# EAGLE schematic ElectroLab (EAGLE 9.5.1)

## Sheet 1 of 4
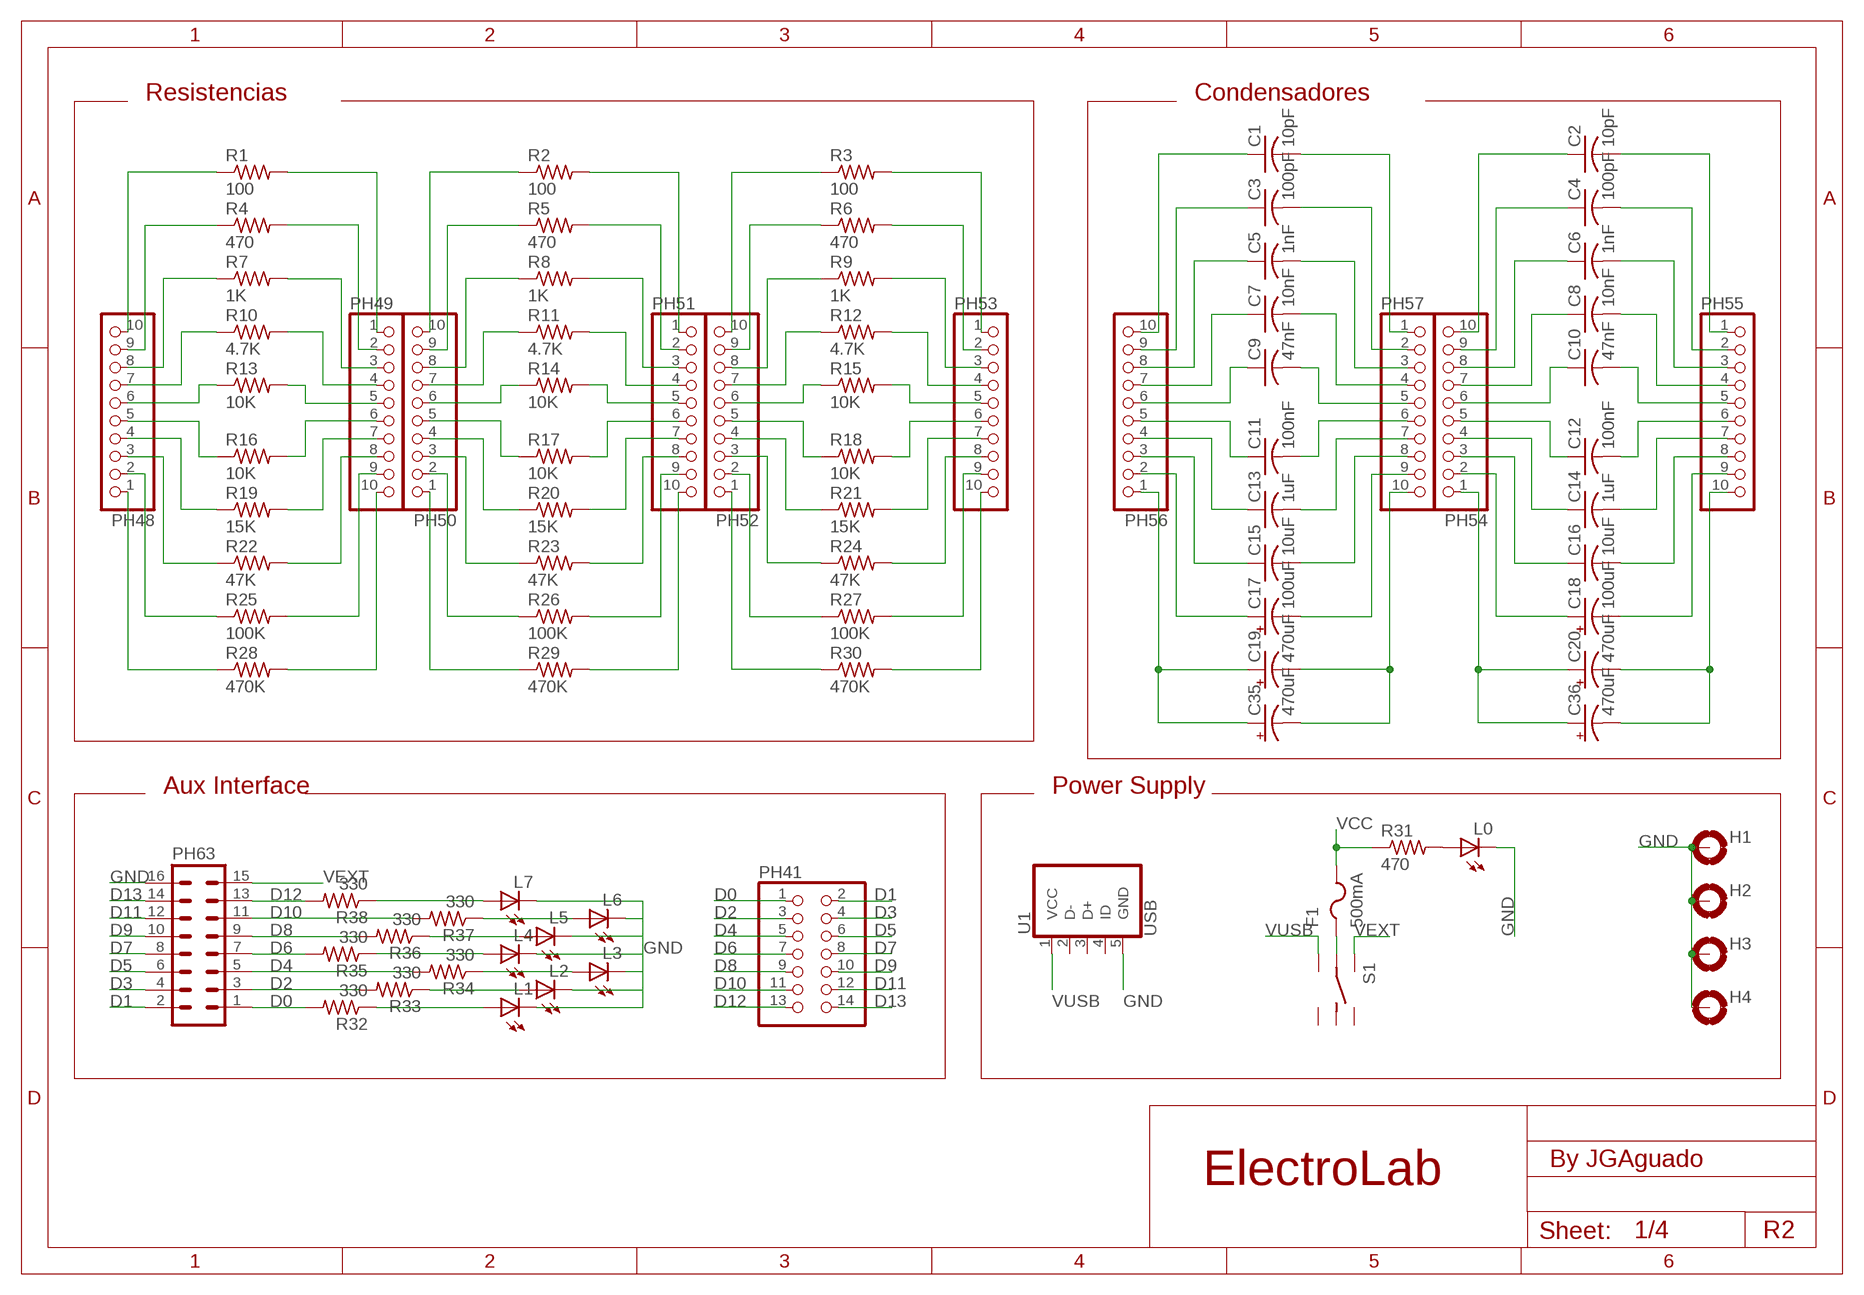
[diagram p0: schematic, sheet 1]

### Parts
C1  10pF  C-USC1206  [C1206]
C2  10pF  C-USC1206  [C1206]
C3  100pF  C-USC1206  [C1206]
C4  100pF  C-USC1206  [C1206]
C5  1nF  C-USC1206  [C1206]
C6  1nF  C-USC1206  [C1206]
C7  10nF  C-USC1206  [C1206]
C8  10nF  C-USC1206  [C1206]
C9  47nF  C-USC1206  [C1206]
C10  47nF  C-USC1206  [C1206]
C11  100nF  C-USC1206  [C1206]
C12  100nF  C-USC1206  [C1206]
C13  1uF  C-USC1206  [C1206]
C14  1uF  C-USC1206  [C1206]
C15  10uF  C-USC1206  [C1206]
C16  10uF  C-USC1206  [C1206]
C17  100uF  CPOL-USA/3216-18R  [A/3216-18R]
C18  100uF  CPOL-USA/3216-18R  [A/3216-18R]
C19  470uF  CPOL-USD/7343-31R  [D/7343-31R]
C20  470uF  CPOL-USD/7343-31R  [D/7343-31R]
C35  470uF  CPOL-USD/7343-31R  [D/7343-31R]
C36  470uF  CPOL-USD/7343-31R  [D/7343-31R]
F1  500mA  PTCFUSE-1206  [R1206]
H1  MOUNT-PAD-ROUND2.8  [2,8-PAD]
H2  MOUNT-PAD-ROUND2.8  [2,8-PAD]
H3  MOUNT-PAD-ROUND2.8  [2,8-PAD]
H4  MOUNT-PAD-ROUND2.8  [2,8-PAD]
L0  LEDSMT1206  [1206]
L1  LEDSMT1206  [1206]
L2  LEDSMT1206  [1206]
L3  LEDSMT1206  [1206]
L4  LEDSMT1206  [1206]
L5  LEDSMT1206  [1206]
L6  LEDSMT1206  [1206]
L7  LEDSMT1206  [1206]
PH41  PINHD-2X7  [2X07]
PH48  PINHD-1X10  [1X10-BIG]
PH49  PINHD-1X10  [1X10-BIG]
PH50  PINHD-1X10  [1X10-BIG]
PH51  PINHD-1X10  [1X10-BIG]
PH52  PINHD-1X10  [1X10-BIG]
PH53  PINHD-1X10  [1X10-BIG]
PH54  PINHD-1X10  [1X10-BIG]
PH55  PINHD-1X10  [1X10-BIG]
PH56  PINHD-1X10  [1X10-BIG]
PH57  PINHD-1X10  [1X10-BIG]
PH63  MA08-2  [MA08-2]
R1  100  R-US_R1206  [R1206]
R2  100  R-US_R1206  [R1206]
R3  100  R-US_R1206  [R1206]
R4  470  R-US_R1206  [R1206]
R5  470  R-US_R1206  [R1206]
R6  470  R-US_R1206  [R1206]
R7  1K  R-US_R1206  [R1206]
R8  1K  R-US_R1206  [R1206]
R9  1K  R-US_R1206  [R1206]
R10  4.7K  R-US_R1206  [R1206]
R11  4.7K  R-US_R1206  [R1206]
R12  4.7K  R-US_R1206  [R1206]
R13  10K  R-US_R1206  [R1206]
R14  10K  R-US_R1206  [R1206]
R15  10K  R-US_R1206  [R1206]
R16  10K  R-US_R1206  [R1206]
R17  10K  R-US_R1206  [R1206]
R18  10K  R-US_R1206  [R1206]
R19  15K  R-US_R1206  [R1206]
R20  15K  R-US_R1206  [R1206]
R21  15K  R-US_R1206  [R1206]
R22  47K  R-US_R1206  [R1206]
R23  47K  R-US_R1206  [R1206]
R24  47K  R-US_R1206  [R1206]
R25  100K  R-US_R1206  [R1206]
R26  100K  R-US_R1206  [R1206]
R27  100K  R-US_R1206  [R1206]
R28  470K  R-US_R1206  [R1206]
R29  470K  R-US_R1206  [R1206]
R30  470K  R-US_R1206  [R1206]
R31  470  R-US_R1206  [R1206]
R32  330  R-US_R1206  [R1206]
R33  330  R-US_R1206  [R1206]
R34  330  R-US_R1206  [R1206]
R35  330  R-US_R1206  [R1206]
R36  330  R-US_R1206  [R1206]
R37  330  R-US_R1206  [R1206]
R38  330  R-US_R1206  [R1206]
S1  DPDT_JS202011CQN  [DPDT_JS202011CQN]
U1  USB  USB-RECEPTABLE  [FCI-10103594-0001LF]

### Nets
D0: PH41.1 PH63.1 R32.2
D1: PH41.2 PH63.2
D2: PH41.3 PH63.3 R33.2
D3: PH41.4 PH63.4
D4: PH41.5 PH63.5 R34.2
D5: PH41.6 PH63.6
D6: PH41.7 PH63.7 R35.2
D7: PH41.8 PH63.8
D8: PH41.9 PH63.9 R36.2
D9: PH41.10 PH63.10
D10: PH41.11 PH63.11 R37.2
D11: PH41.12 PH63.12
D12: PH41.13 PH63.13 R38.2
D13: PH41.14 PH63.14
GND: H1.B2,8(MOUNT) H2.B2,8(MOUNT) H3.B2,8(MOUNT) H4.B2,8(MOUNT) L0.C L1.C L2.C L3.C L4.C L5.C L6.C L7.C PH63.16 U1.5(GND) ; also sheet 2,3,4
N$1: PH48.10 R1.1
N$2: PH48.9 R4.1
N$3: PH48.8 R7.1
N$4: PH48.7 R10.1
N$5: PH48.6 R13.1
N$6: PH48.5 R16.1
N$7: PH48.4 R19.1
N$8: PH48.3 R22.1
N$9: PH48.2 R25.1
N$10: PH48.1 R28.1
N$11: PH49.10 R28.2
N$12: PH49.9 R25.2
N$13: PH49.8 R22.2
N$14: PH49.7 R19.2
N$15: PH49.5 R13.2
N$16: PH49.6 R16.2
N$17: PH49.4 R10.2
N$18: PH49.3 R7.2
N$19: PH49.2 R4.2
N$20: PH49.1 R1.2
N$21: PH50.10 R2.1
N$22: PH50.9 R5.1
N$23: PH50.8 R8.1
N$24: PH50.7 R11.1
N$25: PH50.6 R14.1
N$26: PH50.5 R17.1
N$27: PH50.4 R20.1
N$28: PH50.3 R23.1
N$29: PH50.2 R26.1
N$30: PH50.1 R29.1
N$31: PH51.10 R29.2
N$32: PH51.9 R26.2
N$33: PH51.8 R23.2
N$34: PH51.7 R20.2
N$35: PH51.6 R17.2
N$36: PH51.5 R14.2
N$37: PH51.4 R11.2
N$38: PH51.3 R8.2
N$39: PH51.2 R5.2
N$40: PH51.1 R2.2
N$41: PH52.10 R3.1
N$42: PH52.9 R6.1
N$43: PH52.8 R9.1
N$44: PH52.7 R12.1
N$45: PH52.6 R15.1
N$46: PH52.5 R18.1
N$47: PH52.4 R21.1
N$48: PH52.3 R24.1
N$49: PH52.2 R27.1
N$50: PH52.1 R30.1
N$51: PH53.10 R30.2
N$52: PH53.9 R27.2
N$53: PH53.8 R24.2
N$54: PH53.7 R21.2
N$55: PH53.6 R18.2
N$56: PH53.5 R15.2
N$57: PH53.4 R12.2
N$58: PH53.3 R9.2
N$59: PH53.2 R6.2
N$60: PH53.1 R3.2
N$61: C1.1 PH56.10
N$62: C3.1 PH56.9
N$63: C5.1 PH56.8
N$64: C7.1 PH56.7
N$65: C9.1 PH56.6
N$66: C11.1 PH56.5
N$67: C13.1 PH56.4
N$68: C15.1 PH56.3
N$69: C17.+ PH56.2
N$70: C19.+ C35.+ PH56.1
N$71: C1.2 PH57.1
N$72: C3.2 PH57.2
N$73: C5.2 PH57.3
N$74: C7.2 PH57.4
N$75: C9.2 PH57.5
N$76: C11.2 PH57.6
N$77: C13.2 PH57.7
N$78: C15.2 PH57.8
N$79: C17.- PH57.9
N$80: C19.- C35.- PH57.10
N$81: C2.1 PH54.10
N$82: C4.1 PH54.9
N$83: C6.1 PH54.8
N$84: C8.1 PH54.7
N$85: C10.1 PH54.6
N$86: C12.1 PH54.5
N$87: C14.1 PH54.4
N$88: C16.1 PH54.3
N$89: C18.+ PH54.2
N$90: C20.+ C36.+ PH54.1
N$91: C20.- C36.- PH55.10
N$92: C18.- PH55.9
N$93: C16.2 PH55.8
N$94: C14.2 PH55.7
N$95: C12.2 PH55.6
N$96: C10.2 PH55.5
N$97: C8.2 PH55.4
N$98: C6.2 PH55.3
N$99: C4.2 PH55.2
N$100: C2.2 PH55.1
N$102: L1.A R32.1
N$103: L0.A R31.2
N$104: L2.A R33.1
N$105: L3.A R34.1
N$106: L4.A R35.1
N$107: L5.A R36.1
N$108: L6.A R37.1
N$109: L7.A R38.1
N$118: F1.1 S1.2(LC)
VCC: F1.2 R31.1 ; also sheet 2,3,4
VEXT: PH63.15 S1.1(L1)
VUSB: S1.3(L2) U1.1(VCC)
Unconnected: S1.4(R1) S1.5(RC) S1.6(R2) U1.2(D-) U1.3(D+) U1.4(ID)

### Notes on the sheet
- Resistencias | Condensadores
- Aux Interface | Power Supply
- By JGAguado
- R2

## Sheet 2 of 4
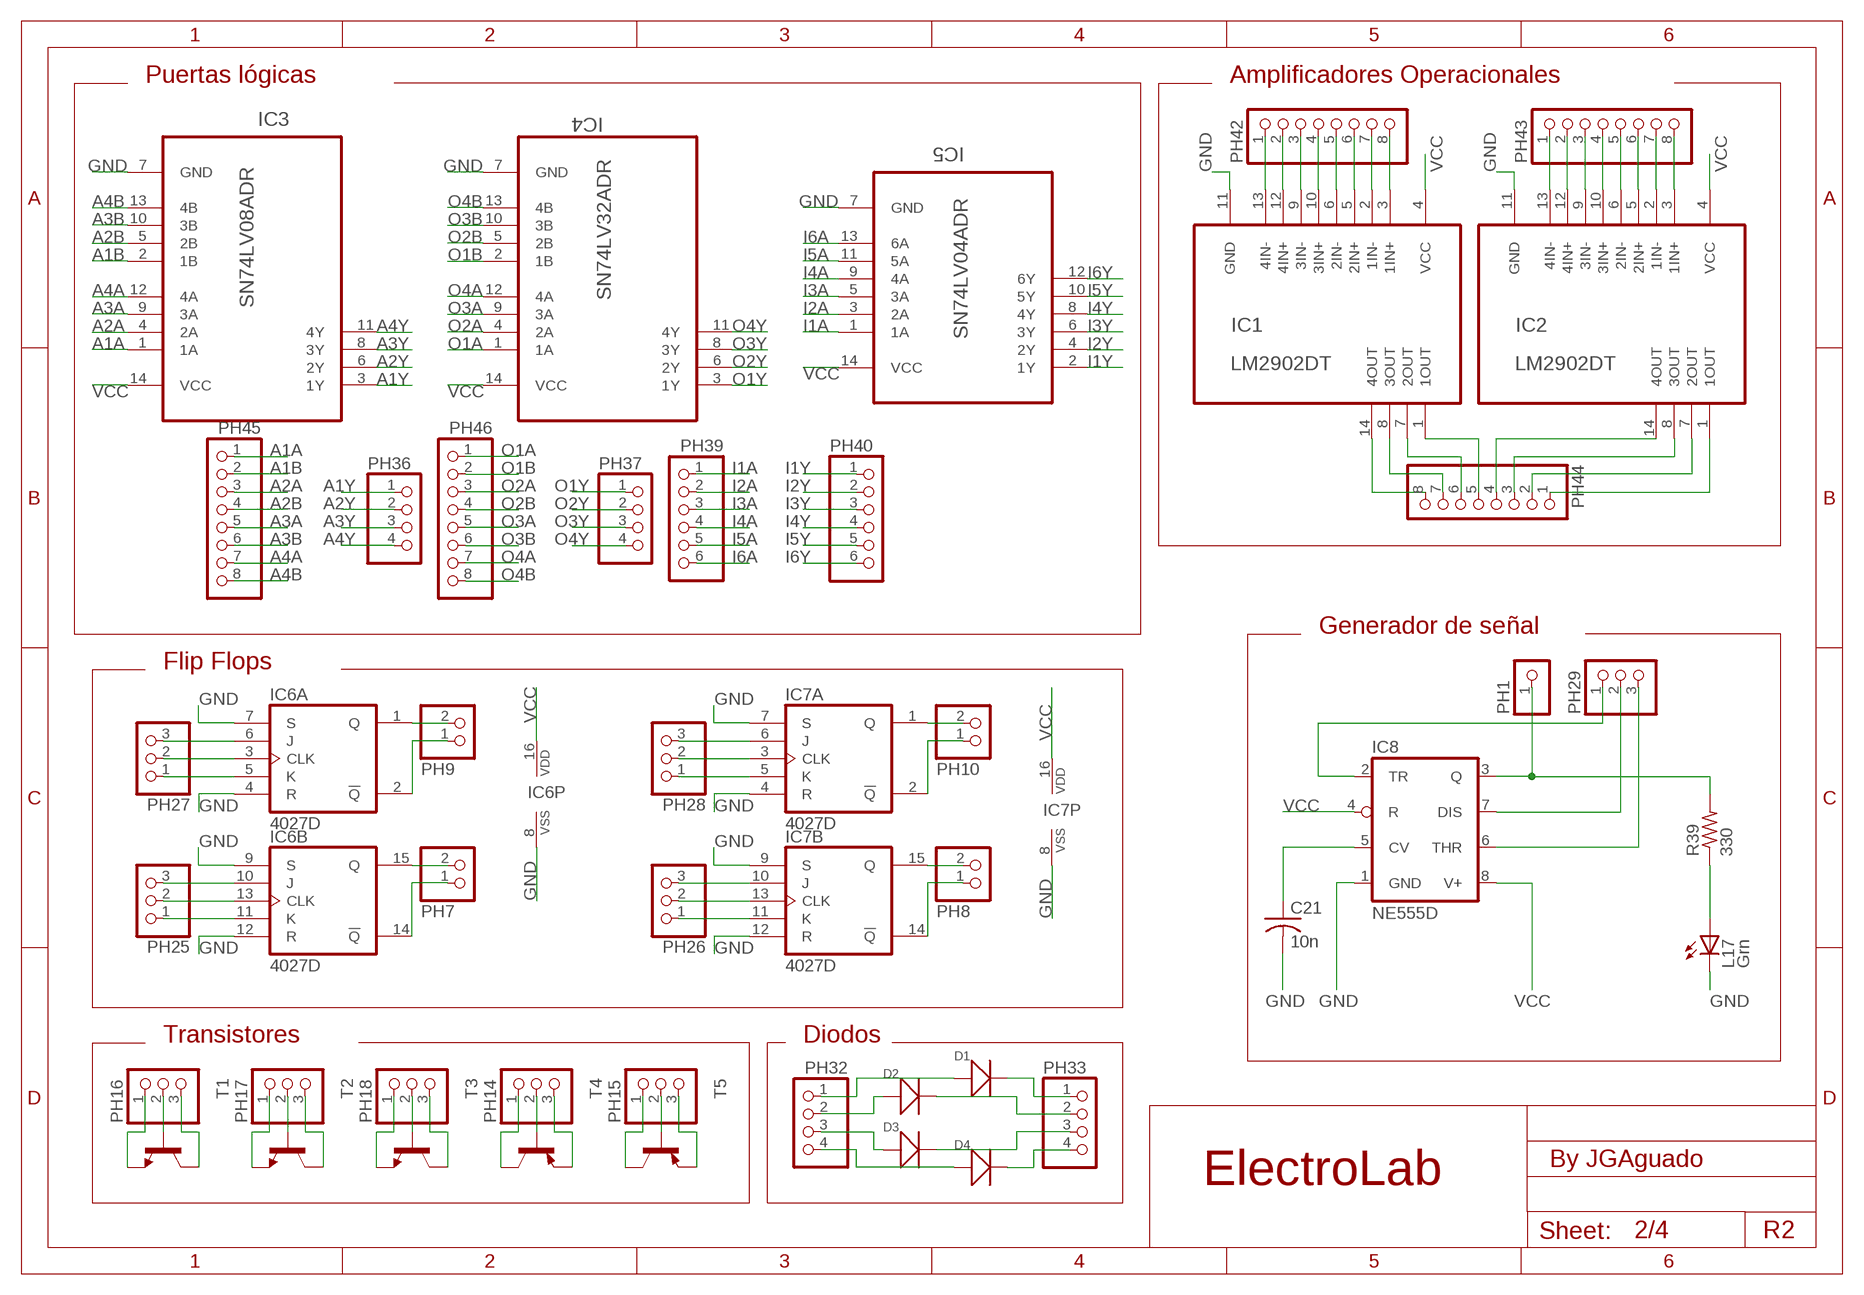
[diagram p1: schematic, sheet 2]

### Parts
C21  10n  C0603  [0603]
D1  SMD-DIODE-SWITCHING-75V-150MA(D1206)  [LED-1206]
D2  SMD-DIODE-SWITCHING-75V-150MA(D1206)  [LED-1206]
D3  SMD-DIODE-SWITCHING-75V-150MA(D1206)  [LED-1206]
D4  SMD-DIODE-SWITCHING-75V-150MA(D1206)  [LED-1206]
IC1  LM2902DT  [SOIC127P600X175-14N]
IC2  LM2902DT  [SOIC127P600X175-14N]
IC3  SN74LV08ADR  SN74LVC08AD  [SOIC127P600X175-14N]
IC4  SN74LV32ADR  SN74S32D  [SOIC127P600X175-14N]
IC5  SN74LV04ADR  [SOIC127P600X175-14N]
IC6  4027D  [SO16]
IC7  4027D  [SO16]
IC8  NE555D  [SO08]
L17  Grn  LEDSMT1206  [1206]
PH1  PINHD-1X1  [1X01]
PH7  PINHD-1X2  [1X02]
PH8  PINHD-1X2  [1X02]
PH9  PINHD-1X2  [1X02]
PH10  PINHD-1X2  [1X02]
PH14  PINHD-1X3  [1X03]
PH15  PINHD-1X3  [1X03]
PH16  PINHD-1X3  [1X03]
PH17  PINHD-1X3  [1X03]
PH18  PINHD-1X3  [1X03]
PH25  PINHD-1X3  [1X03]
PH26  PINHD-1X3  [1X03]
PH27  PINHD-1X3  [1X03]
PH28  PINHD-1X3  [1X03]
PH29  PINHD-1X3  [1X03]
PH32  PINHD-1X4  [1X04]
PH33  PINHD-1X4  [1X04]
PH36  PINHD-1X4  [1X04]
PH37  PINHD-1X4  [1X04]
PH39  PINHD-1X6  [1X06]
PH40  PINHD-1X6  [1X06]
PH42  PINHD-1X8  [1X08]
PH43  PINHD-1X8  [1X08]
PH44  PINHD-1X8  [1X08]
PH45  PINHD-1X8  [1X08]
PH46  PINHD-1X8  [1X08]
R39  330  R-US_R1206  [R1206]
T1  BC817-16-NPN-SOT23-BEC  [SOT23-BEC]
T2  BC817-16-NPN-SOT23-BEC  [SOT23-BEC]
T3  BC817-16-NPN-SOT23-BEC  [SOT23-BEC]
T4  -PNP-SOT23-BCE  [SOT23-BCE]
T5  -PNP-SOT23-BCE  [SOT23-BCE]

### Nets
A1A: IC3.1(1A) PH45.1 ; also sheet 4
A1B: IC3.2(1B) PH45.2 ; also sheet 4
A1Y: IC3.3(1Y) PH36.1
A2A: IC3.4(2A) PH45.3 ; also sheet 4
A2B: IC3.5(2B) PH45.4 ; also sheet 4
A2Y: IC3.6(2Y) PH36.2
A3A: IC3.9(3A) PH45.5 ; also sheet 4
A3B: IC3.10(3B) PH45.6 ; also sheet 4
A3Y: IC3.8(3Y) PH36.3
A4A: IC3.12(4A) PH45.7 ; also sheet 4
A4B: IC3.13(4B) PH45.8 ; also sheet 4
A4Y: IC3.11(4Y) PH36.4
GND: C21.2 IC1.11(GND) IC2.11(GND) IC3.7(GND) IC4.7(GND) IC5.7(GND) IC6.4(A:R) IC6.7(A:S) IC6.8(P:VSS) IC6.9(B:S) IC6.12(B:R) IC7.4(A:R) IC7.7(A:S) IC7.8(P:VSS) IC7.9(B:S) IC7.12(B:R) IC8.1(GND) L17.C ; also sheet 1,3,4
I1A: IC5.1(1A) PH39.1 ; also sheet 4
I1Y: IC5.2(1Y) PH40.1
I2A: IC5.3(2A) PH39.2 ; also sheet 4
I2Y: IC5.4(2Y) PH40.2
I3A: IC5.5(3A) PH39.3 ; also sheet 4
I3Y: IC5.6(3Y) PH40.3
I4A: IC5.9(4A) PH39.4 ; also sheet 4
I4Y: IC5.8(4Y) PH40.4
I5A: IC5.11(5A) PH39.5 ; also sheet 4
I5Y: IC5.10(5Y) PH40.5
I6A: IC5.13(6A) PH39.6 ; also sheet 4
I6Y: IC5.12(6Y) PH40.6
N$101: D4.+ PH32.4
N$110: D4.- PH33.4
N$111: D1.+ PH32.1
N$112: IC6.1(A:Q) PH9.2
N$113: IC6.15(B:Q) PH7.2
N$114: IC7.1(A:Q) PH10.2
N$115: IC7.15(B:Q) PH8.2
N$122: L17.A R39.1
N$130: IC1.13(4IN-) PH42.1
N$131: IC1.12(4IN+) PH42.2
N$132: IC1.9(3IN-) PH42.3
N$133: IC1.10(3IN+) PH42.4
N$134: IC1.6(2IN-) PH42.5
N$135: IC1.5(2IN+) PH42.6
N$136: IC1.2(1IN-) PH42.7
N$137: IC1.3(1IN+) PH42.8
N$138: IC2.13(4IN-) PH43.1
N$146: IC6.5(A:K) PH27.1
N$155: IC6.3(A:CLK) PH27.2
N$156: IC6.6(A:J) PH27.3
N$157: IC6.11(B:K) PH25.1
N$158: IC6.13(B:CLK) PH25.2
N$159: IC6.10(B:J) PH25.3
N$160: IC7.5(A:K) PH28.1
N$161: IC7.3(A:CLK) PH28.2
N$162: IC7.6(A:J) PH28.3
N$171: IC7.11(B:K) PH26.1
N$172: IC7.13(B:CLK) PH26.2
N$173: IC7.10(B:J) PH26.3
N$178: IC6.2(A:!Q) PH9.1
N$179: IC6.14(B:!Q) PH7.1
N$180: IC7.2(A:!Q) PH10.1
N$181: IC7.14(B:!Q) PH8.1
N$183: D3.+ PH32.3
N$184: D2.+ PH32.2
N$186: IC2.12(4IN+) PH43.2
N$187: IC2.9(3IN-) PH43.3
N$188: IC2.10(3IN+) PH43.4
N$189: IC2.6(2IN-) PH43.5
N$190: IC2.5(2IN+) PH43.6
N$191: IC2.2(1IN-) PH43.7
N$192: IC2.3(1IN+) PH43.8
N$193: IC1.14(4OUT) PH44.8
N$194: IC1.8(3OUT) PH44.7
N$195: IC1.7(2OUT) PH44.6
N$196: IC1.1(1OUT) PH44.5
N$197: IC2.14(4OUT) PH44.4
N$198: IC2.8(3OUT) PH44.3
N$199: D1.- PH33.1
N$200: IC2.7(2OUT) PH44.2
N$201: IC2.1(1OUT) PH44.1
N$202: D2.- PH33.2
N$203: D3.- PH33.3
N$205: PH16.1 T1.E
N$206: PH16.2 T1.B
N$207: PH16.3 T1.C
N$208: PH17.1 T2.E
N$209: PH17.2 T2.B
N$210: PH17.3 T2.C
N$211: PH18.1 T3.E
N$212: PH18.2 T3.B
N$213: PH18.3 T3.C
N$217: PH14.1 T4.C
N$218: PH14.2 T4.B
N$219: PH14.3 T4.E
N$220: PH15.1 T5.C
N$221: PH15.2 T5.B
N$222: PH15.3 T5.E
N$223: IC8.2(TR) PH29.1
N$224: IC8.3(Q) PH1.1 R39.2
N$225: C21.1 IC8.5(CV)
N$226: IC8.7(DIS) PH29.2
N$227: IC8.6(THR) PH29.3
O1A: IC4.1(1A) PH46.1 ; also sheet 4
O1B: IC4.2(1B) PH46.2 ; also sheet 4
O1Y: IC4.3(1Y) PH37.1
O2A: IC4.4(2A) PH46.3 ; also sheet 4
O2B: IC4.5(2B) PH46.4 ; also sheet 4
O2Y: IC4.6(2Y) PH37.2
O3A: IC4.9(3A) PH46.5 ; also sheet 4
O3B: IC4.10(3B) PH46.6 ; also sheet 4
O3Y: IC4.8(3Y) PH37.3
O4A: IC4.12(4A) PH46.7 ; also sheet 4
O4B: IC4.13(4B) PH46.8 ; also sheet 4
O4Y: IC4.11(4Y) PH37.4
VCC: IC1.4(VCC) IC2.4(VCC) IC3.14(VCC) IC4.14(VCC) IC5.14(VCC) IC6.16(P:VDD) IC7.16(P:VDD) IC8.4(R) IC8.8(V+) ; also sheet 1,3,4

### Notes on the sheet
- Puertas lógicas | Amplificadores Operacionales
- Generador de señal
- Flip Flops
- Transistores | Diodos
- By JGAguado
- R2

## Sheet 3 of 4
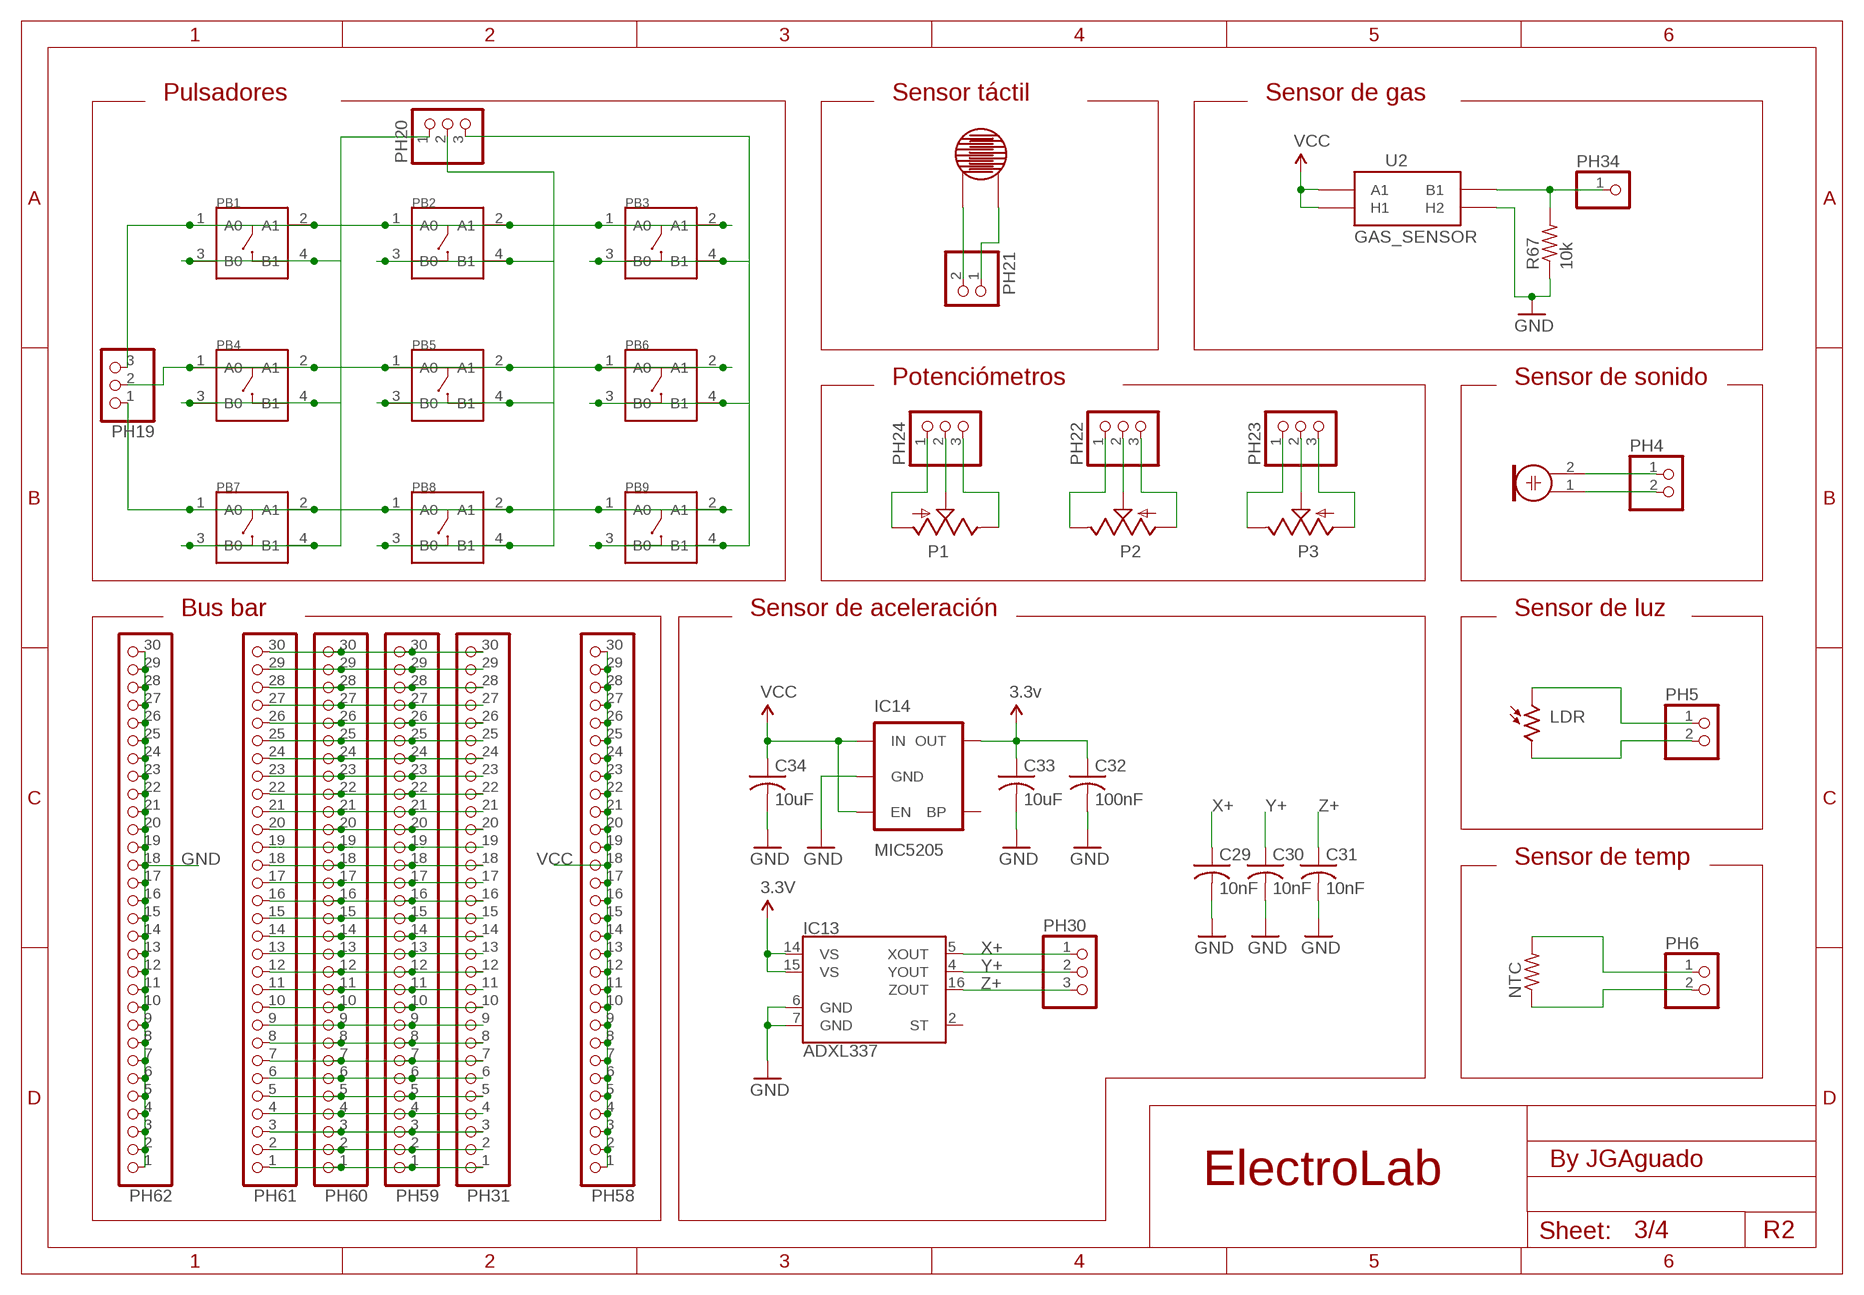
[diagram p2: schematic, sheet 3]

### Parts
C29  10nF  C0603  [0603]
C30  10nF  C0603  [0603]
C31  10nF  C0603  [0603]
C32  100nF  C0603  [0603]
C33  10uF  C0603  [0603]
C34  10uF  C0603  [0603]
IC13  ADXL337  [LFCSP-3X3]
IC14  MIC5205  V_REG_LDOSMD  [SOT23-5]
LDR  V1060_21  [TO-5_V10]
MIC  ELECTRET_MICROPHON-WM-64PC/64PK  [WM-64PC/64PK]
NTC  R-US_R1206  [R1206@1]
P1  SLIDE_POT_20MM  [SLIDE_POT_20MM]
P2  ALPS_RK09K_VERTICAL  [ALPS_RK09K_VERTICAL]
P3  ALPS_RK09K_VERTICAL  [ALPS_RK09K_VERTICAL]
PB1  SMD-SWITCH-TACTILE-SPST-NO/TS-1109(4P-D6.0MM)  [SW4-SMD-6.0X6.0X5.0MM]
PB2  SMD-SWITCH-TACTILE-SPST-NO/TS-1109(4P-D6.0MM)  [SW4-SMD-6.0X6.0X5.0MM]
PB3  SMD-SWITCH-TACTILE-SPST-NO/TS-1109(4P-D6.0MM)  [SW4-SMD-6.0X6.0X5.0MM]
PB4  SMD-SWITCH-TACTILE-SPST-NO/TS-1109(4P-D6.0MM)  [SW4-SMD-6.0X6.0X5.0MM]
PB5  SMD-SWITCH-TACTILE-SPST-NO/TS-1109(4P-D6.0MM)  [SW4-SMD-6.0X6.0X5.0MM]
PB6  SMD-SWITCH-TACTILE-SPST-NO/TS-1109(4P-D6.0MM)  [SW4-SMD-6.0X6.0X5.0MM]
PB7  SMD-SWITCH-TACTILE-SPST-NO/TS-1109(4P-D6.0MM)  [SW4-SMD-6.0X6.0X5.0MM]
PB8  SMD-SWITCH-TACTILE-SPST-NO/TS-1109(4P-D6.0MM)  [SW4-SMD-6.0X6.0X5.0MM]
PB9  SMD-SWITCH-TACTILE-SPST-NO/TS-1109(4P-D6.0MM)  [SW4-SMD-6.0X6.0X5.0MM]
PH4  PINHD-1X2  [1X02]
PH5  PINHD-1X2  [1X02]
PH6  PINHD-1X2  [1X02]
PH19  PINHD-1X3  [1X03]
PH20  PINHD-1X3  [1X03]
PH21  PINHD-1X2  [1X02]
PH22  PINHD-1X3  [1X03]
PH23  PINHD-1X3  [1X03]
PH24  PINHD-1X3  [1X03]
PH30  PINHD-1X3  [1X03]
PH31  PINHD-1X30  [1X30]
PH34  PINHD-1X1  [1X01]
PH58  PINHD-1X30  [1X30]
PH59  PINHD-1X30  [1X30]
PH60  PINHD-1X30  [1X30]
PH61  PINHD-1X30  [1X30]
PH62  PINHD-1X30  [1X30]
R67  10k  R0603  [0603]
U2  GAS_SENSOR  [MQ-3]
U$16  RESISTIVE_SENSOR_PAD  [RESISTIVE_SENSOR_PAD]

### Nets
3.3V: C32.1 C33.1 IC13.14(VS) IC13.15(VS) IC14.5(OUT) ; supply symbol labelled 3.3v
GND: C29.2 C30.2 C31.2 C32.2 C33.2 C34.2 IC13.6(GND) IC13.7(GND) IC14.2(GND) PH62.1 PH62.2 PH62.3 PH62.4 PH62.5 PH62.6 PH62.7 PH62.8 PH62.9 PH62.10 PH62.11 PH62.12 PH62.13 PH62.14 PH62.15 PH62.16 PH62.17 PH62.18 PH62.19 PH62.20 PH62.21 PH62.22 PH62.23 PH62.24 PH62.25 PH62.26 PH62.27 PH62.28 PH62.29 PH62.30 R67.1 U2.HB(H2) ; also sheet 1,2,4
N$119: PH34.1 R67.2 U2.B1
N$125: PH21.1 U$16.0
N$126: PH21.2 U$16.1
N$127: PH31.7 PH59.7 PH60.7 PH61.7
N$128: PH31.1 PH59.1 PH60.1 PH61.1
N$129: PH31.2 PH59.2 PH60.2 PH61.2
N$139: PH31.3 PH59.3 PH60.3 PH61.3
N$140: PH31.4 PH59.4 PH60.4 PH61.4
N$141: PH31.5 PH59.5 PH60.5 PH61.5
N$142: PH31.6 PH59.6 PH60.6 PH61.6
N$143: PH31.8 PH59.8 PH60.8 PH61.8
N$144: PH31.9 PH59.9 PH60.9 PH61.9
N$145: PH31.10 PH59.10 PH60.10 PH61.10
N$147: PH31.11 PH59.11 PH60.11 PH61.11
N$148: PH31.12 PH59.12 PH60.12 PH61.12
N$149: PH31.13 PH59.13 PH60.13 PH61.13
N$150: PH31.14 PH59.14 PH60.14 PH61.14
N$151: PH31.15 PH59.15 PH60.15 PH61.15
N$152: PH31.16 PH59.16 PH60.16 PH61.16
N$153: PH31.17 PH59.17 PH60.17 PH61.17
N$154: PH31.18 PH59.18 PH60.18 PH61.18
N$163: PH31.19 PH59.19 PH60.19 PH61.19
N$164: PH31.20 PH59.20 PH60.20 PH61.20
N$165: PH31.21 PH59.21 PH60.21 PH61.21
N$166: PH31.22 PH59.22 PH60.22 PH61.22
N$167: PH31.23 PH59.23 PH60.23 PH61.23
N$168: PH31.24 PH59.24 PH60.24 PH61.24
N$169: PH31.25 PH59.25 PH60.25 PH61.25
N$170: PH31.26 PH59.26 PH60.26 PH61.26
N$174: PH31.27 PH59.27 PH60.27 PH61.27
N$175: PH31.28 PH59.28 PH60.28 PH61.28
N$176: PH31.29 PH59.29 PH60.29 PH61.29
N$177: PH31.30 PH59.30 PH60.30 PH61.30
N$228: PB1.1(A0) PB1.2(A1) PB2.1(A0) PB2.2(A1) PB3.1(A0) PB3.2(A1) PH19.3
N$229: PB4.1(A0) PB4.2(A1) PB5.1(A0) PB5.2(A1) PB6.1(A0) PB6.2(A1) PH19.2
N$230: PB7.1(A0) PB7.2(A1) PB8.1(A0) PB8.2(A1) PB9.1(A0) PB9.2(A1) PH19.1
N$231: PB1.3(B0) PB1.4(B1) PB4.3(B0) PB4.4(B1) PB7.3(B0) PB7.4(B1) PH20.1
N$232: PB2.3(B0) PB2.4(B1) PB5.3(B0) PB5.4(B1) PB8.3(B0) PB8.4(B1) PH20.2
N$233: PB3.3(B0) PB3.4(B1) PB6.3(B0) PB6.4(B1) PB9.3(B0) PB9.4(B1) PH20.3
N$234: LDR.1 PH5.1
N$235: LDR.2 PH5.2
N$236: NTC.2 PH6.1
N$237: P2.3 PH22.1
N$238: P2.2 PH22.2
N$239: P2.1 PH22.3
N$240: P1.3 PH24.1
N$241: P1.2 PH24.2
N$242: P1.1 PH24.3
N$243: P3.3 PH23.1
N$244: P3.2 PH23.2
N$245: P3.1 PH23.3
N$249: MIC.2 PH4.1
N$250: MIC.1 PH4.2
N$256: NTC.1 PH6.2
VCC: C34.1 IC14.1(IN) IC14.3(EN) PH58.1 PH58.2 PH58.3 PH58.4 PH58.5 PH58.6 PH58.7 PH58.8 PH58.9 PH58.10 PH58.11 PH58.12 PH58.13 PH58.14 PH58.15 PH58.16 PH58.17 PH58.18 PH58.19 PH58.20 PH58.21 PH58.22 PH58.23 PH58.24 PH58.25 PH58.26 PH58.27 PH58.28 PH58.29 PH58.30 U2.A1 U2.HA(H1) ; also sheet 1,2,4
X+: C29.1 IC13.5(XOUT) PH30.1
Y+: C30.1 IC13.4(YOUT) PH30.2
Z+: C31.1 IC13.16(ZOUT) PH30.3
Unconnected: IC13.2(ST) IC14.4(BP)

### Notes on the sheet
- Pulsadores | Sensor táctil | Sensor de gas
- Potenciómetros | Sensor de sonido
- Bus bar | Sensor de aceleración | Sensor de luz
- Sensor de temp
- By JGAguado
- R2

## Sheet 4 of 4
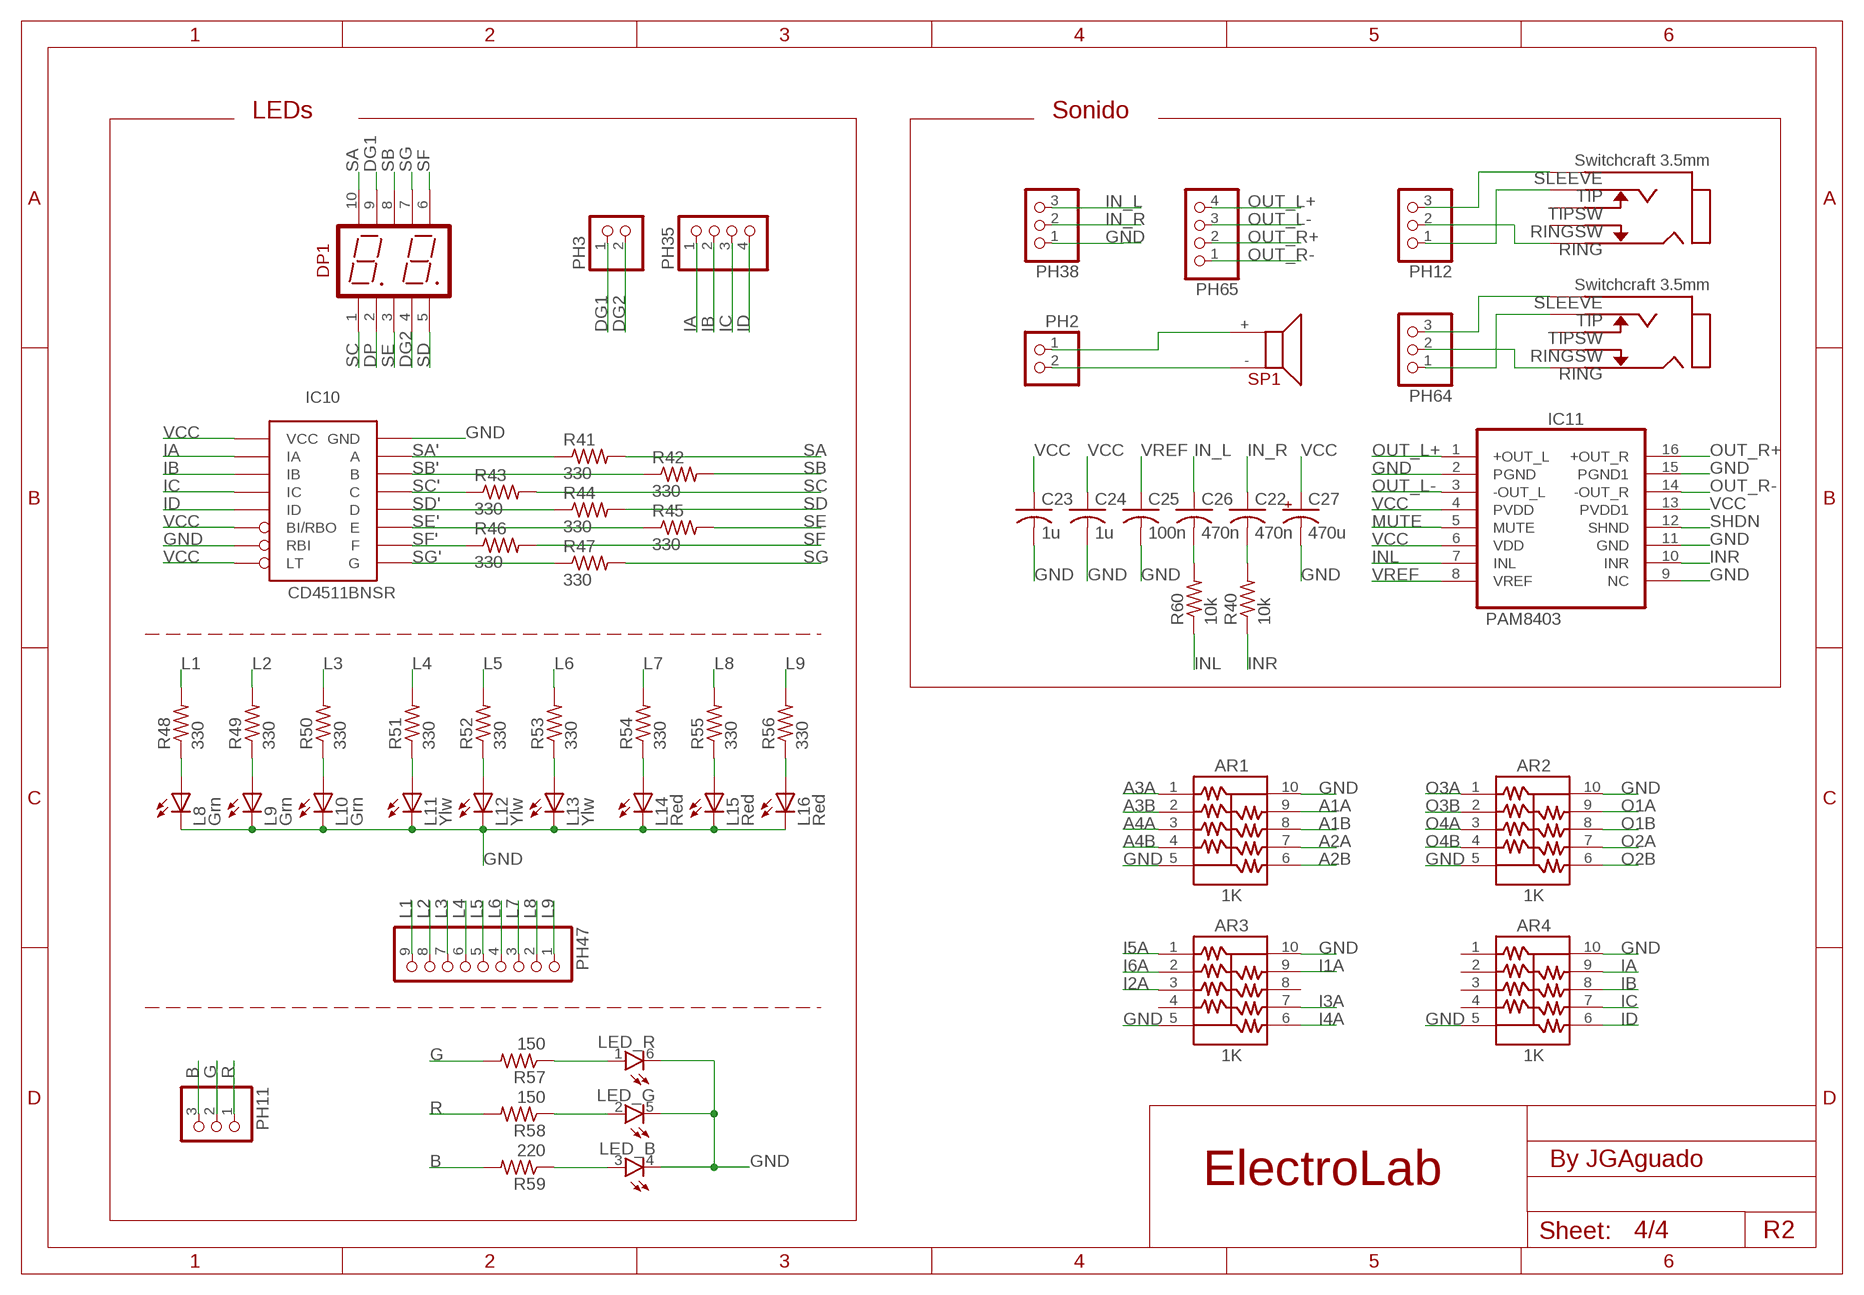
[diagram p3: schematic, sheet 4]

### Parts
AR1  1K  RESISTOR_ARRAY_X8_CAY17  [RESISTOR_ARRAY_X8_CAY17]
AR2  1K  RESISTOR_ARRAY_X8_CAY17  [RESISTOR_ARRAY_X8_CAY17]
AR3  1K  RESISTOR_ARRAY_X8_CAY17  [RESISTOR_ARRAY_X8_CAY17]
AR4  1K  RESISTOR_ARRAY_X8_CAY17  [RESISTOR_ARRAY_X8_CAY17]
C22  470n  C0603  [0603]
C23  1u  C0603  [0603]
C24  1u  C0603  [0603]
C25  100n  C0603  [0603]
C26  470n  C0603  [0603]
C27  470u  CPOL-USD/7343-31W  [D/7343-31W]
DP1  2X7_SEGMENT_COMMON_CATODE_12_PINS  [2X7_SEGMENT_COMMON_CATODE_12_PINS]
IC10  CD4511BNSR  SN74LS247D  [SN74LS247D]
IC11  PAM8403  [SOP-16]
JC1  SWTCHCRFT_3.5JACK5-JACK-SMD  [4-JACK-SMD]
JC2  SWTCHCRFT_3.5JACK5-JACK-SMD  [4-JACK-SMD]
L8  Grn  LEDSMT1206  [1206]
L9  Grn  LEDSMT1206  [1206]
L10  Grn  LEDSMT1206  [1206]
L11  Ylw  LEDSMT1206  [1206]
L12  Ylw  LEDSMT1206  [1206]
L13  Ylw  LEDSMT1206  [1206]
L14  Red  LEDSMT1206  [1206]
L15  Red  LEDSMT1206  [1206]
L16  Red  LEDSMT1206  [1206]
LED_  LED_RGB_PLCC-6  [PLCC-6]
PH2  PINHD-1X2  [1X02]
PH3  PINHD-1X2  [1X02]
PH11  PINHD-1X3  [1X03]
PH12  PINHD-1X3  [1X03]
PH35  PINHD-1X4  [1X04]
PH38  PINHD-1X3  [1X03]
PH47  PINHD-1X9  [1X09]
PH64  PINHD-1X3  [1X03]
PH65  PINHD-1X4  [1X04]
R40  10k  R0603  [0603]
R41  330  R-US_R1206  [R1206]
R42  330  R-US_R1206  [R1206]
R43  330  R-US_R1206  [R1206]
R44  330  R-US_R1206  [R1206]
R45  330  R-US_R1206  [R1206]
R46  330  R-US_R1206  [R1206]
R47  330  R-US_R1206  [R1206]
R48  330  R-US_R1206  [R1206]
R49  330  R-US_R1206  [R1206]
R50  330  R-US_R1206  [R1206]
R51  330  R-US_R1206  [R1206]
R52  330  R-US_R1206  [R1206]
R53  330  R-US_R1206  [R1206]
R54  330  R-US_R1206  [R1206]
R55  330  R-US_R1206  [R1206]
R56  330  R-US_R1206  [R1206]
R57  150  R-US_R1206  [R1206]
R58  150  R-US_R1206  [R1206]
R59  220  R-US_R1206  [R1206]
R60  10k  R0603  [0603]
SP1  32MM_SPEAKER  [32MM_SPEAKER]

### Nets
A1A: AR1.9 ; also sheet 2
A1B: AR1.8 ; also sheet 2
A2A: AR1.7 ; also sheet 2
A2B: AR1.6 ; also sheet 2
A3A: AR1.1 ; also sheet 2
A3B: AR1.2 ; also sheet 2
A4A: AR1.3 ; also sheet 2
A4B: AR1.4 ; also sheet 2
B: PH11.3 R59.2
DG1: DP1.9 PH3.1
DG2: DP1.4 PH3.2
DP: DP1.2
G: PH11.2 R57.2
GND: AR1.5 AR1.10 AR2.5 AR2.10 AR3.5 AR3.10 AR4.5 AR4.10 C23.2 C24.2 C25.2 C27.- IC10.GND IC10.RBI IC11.2(PGND) IC11.9(NC) IC11.11(GND) IC11.15(PGND1) L8.C L9.C L10.C L11.C L12.C L13.C L14.C L15.C L16.C LED_.4(B:C) LED_.5(G:C) LED_.6(R:C) PH38.1 ; also sheet 1,2,3
I1A: AR3.9 ; also sheet 2
I2A: AR3.3 ; also sheet 2
I3A: AR3.7 ; also sheet 2
I4A: AR3.6 ; also sheet 2
I5A: AR3.1 ; also sheet 2
I6A: AR3.2 ; also sheet 2
IA: AR4.9 IC10.IA PH35.1
IB: AR4.8 IC10.IB PH35.2
IC: AR4.7 IC10.IC PH35.3
ID: AR4.6 IC10.ID PH35.4
IN_L: C26.1 PH38.3
IN_R: C22.1 PH38.2
INL: IC11.7(INL) R60.1
INR: IC11.10(INR) R40.1
JC1: JC1.2 PH12.2
JC2: JC2.2 PH64.2
L1: PH47.9 R48.2
L2: PH47.8 R49.2
L3: PH47.7 R50.2
L4: PH47.6 R51.2
L5: PH47.5 R52.2
L6: PH47.4 R53.2
L7: PH47.3 R54.2
L8: PH47.2 R55.2
L9: PH47.1 R56.2
MUTE: IC11.5(MUTE)
N$116: JC1.3 PH12.1
N$117: LED_.2(G:A) R58.1
N$120: JC2.1 PH64.3
N$121: JC2.3 PH64.1
N$123: C26.2 R60.2
N$124: C22.2 R40.2
N$257: PH2.1 SP1.+
N$264: JC1.1 PH12.3
N$291: PH2.2 SP1.-
N$292: L8.A R48.1
N$300: L9.A R49.1
N$301: L10.A R50.1
N$302: L11.A R51.1
N$303: L12.A R52.1
N$304: L13.A R53.1
N$305: L14.A R54.1
N$306: L15.A R55.1
N$307: L16.A R56.1
N$308: LED_.1(R:A) R57.1
N$310: LED_.3(B:A) R59.1
O1A: AR2.9 ; also sheet 2
O1B: AR2.8 ; also sheet 2
O2A: AR2.7 ; also sheet 2
O2B: AR2.6 ; also sheet 2
O3A: AR2.1 ; also sheet 2
O3B: AR2.2 ; also sheet 2
O4A: AR2.3 ; also sheet 2
O4B: AR2.4 ; also sheet 2
OUT_L+: IC11.1(+OUT_L) PH65.4
OUT_L-: IC11.3(-OUT_L) PH65.3
OUT_R+: IC11.16(+OUT_R) PH65.2
OUT_R-: IC11.14(-OUT_R) PH65.1
R: PH11.1 R58.2
SA: DP1.10 R41.2
SA': IC10.A R41.1
SB: DP1.8 R42.2
SB': IC10.B R42.1
SC: DP1.1 R43.2
SC': IC10.C R43.1
SD: DP1.5 R44.2
SD': IC10.D R44.1
SE: DP1.3 R45.2
SE': IC10.E R45.1
SF: DP1.6 R46.2
SF': IC10.F R46.1
SG: DP1.7 R47.2
SG': IC10.G R47.1
SHDN: IC11.12(SHND)
VCC: C23.1 C24.1 C27.+ IC10.BI/RBO IC10.LT IC10.VCC IC11.4(PVDD) IC11.6(VDD) IC11.13(PVDD1) ; also sheet 1,2,3
VREF: C25.1 IC11.8(VREF)
Unconnected: AR3.4 AR3.8 AR4.1 AR4.2 AR4.3 AR4.4 JC1.4 JC1.5 JC2.4 JC2.5

### Notes on the sheet
- LEDs | Sonido
- By JGAguado
- R2

## Library data of the parts
AR1-AR4 = SpaceDIY:RESISTOR_ARRAY_X8_CAY17: Bourns Model CAY17-102JALF: Resistor Networks & Arrays 1K 5% 10pin Dual Ground 5/10
C1-C16 = resistor:C-US: CAPACITOR, American symbol
C17-C20 C27 C35 C36 = rcl:CPOL-US: POLARIZED CAPACITOR, American symbol; SPICEPREFIX: C
C21-C26 C29-C34 = SpaceDIY_passive_components:C0603
D1-D4 = Seeed-OPL-Diode:SMD-DIODE-SWITCHING-75V-150MA(D1206): 304040005; MPN: CD1206-S01575; VALUE: 75V 150MA
DP1 = SpaceDIY:2X7_SEGMENT_COMMON_CATODE_12_PINS
F1 = adafruit:PTCFUSE: PTC fuses, resettable thermistors
H1-H4 = holes:MOUNT-PAD-ROUND: MOUNTING PAD, round
IC1 IC2 = Texas Instruments_By_element14_Batch_1:LM2902DT: OPERATIONAL AMPLIFIERS; MPN: LM2902DT; OC_FARNELL: 1263036; OC_NEWARK: 89K1301; PACKAGE: SOIC-14; SUPPLIER: TEXAS INSTRUMENTS
IC3 = Texas Instruments_By_element14_Batch_1:SN74LVC08AD: QUADRUPLE 2-INPUT POSITIVE-AND GATES; MPN: SN74LVC08AD; OC_FARNELL: 1102972; OC_NEWARK: 45C6937; PACKAGE: SOIC-14; SUPPLIER: Texas Instruments
IC4 = Texas Instruments_By_element14_Batch_1:SN74S32D: IC QUAD 2IN POS-OR GATE; MPN: SN74S32D; OC_FARNELL: 1741242; OC_NEWARK: 50R6794; PACKAGE: 14-SOIC; SUPPLIER: Texas Instruments
IC5 = Texas Instruments_By_element14_Batch_1:SN74LV04ADR: HEX INVERTERS; MPN: SN74LV04ADR; OC_FARNELL: 1236261; OC_NEWARK: 13M5347; PACKAGE: SOIC-14; SUPPLIER: Texas Instruments
IC6 IC7 = 40xx:4027: Dual JK FLIP FLOP
IC8 = adafruit:*555: TIMER Changed DIP package to have round (not oval) pin pads http://www.ladyada.net/library/pcb/eaglelibrary.html
IC10 = SpaceDIY:SN74LS247D
IC11 = PAM8403:PAM8403: Dual channel audio amplifier IC - PAM8403
IC13 = SpaceDIY_IC:ADXL337
IC14 = SparkFun:V_REG_LDO: Voltage Regulator LDO Standard 150mA LDO voltage regulator in SOT-23 layout. Micrel part MIC5205. BP (by-pass) pin is used to lower output noise with 470pF cap.
JC1 JC2 = jmsaavedra:SWTCHCRFT_3.5JACK: Switchcraft 3.5mm Stereo Audio Jack manufacturer: 35RASMT4BHNTRX digikey: SC1488-1-ND
L0 L1-L17 = adafruit:LED: LED OSRAM: - CHIPLED LG R971, LG N971, LY N971, LG Q971, LY Q971, LO R971, LY R971 LH N974, LH R974 LS Q976, LO Q976, LY Q976 LO Q996 - Hyper CHIPLED LW Q18S LB Q993, LB Q99A, LB R99A - SideLED LS A670, LO A670, LY A670, LG A670, LP A670 LB A673, LV A673, LT A673, LW A673 LH A674 LY A675 LS A676, LA A676, LO A676, LY A676, LW A676 LS A679, LY A679, LG A679 - Hyper Micro SIDELED® LS Y876, LA Y876, LO Y876, LY Y876 LT Y87S - SmartLED LW L88C, LW L88S LB L89C, LB L89S, LG L890 LS L89K, LO L89K, LY L89K LS L896, LA L896, LO L896, LY L896 - TOPLED LS T670, LO T670, LY T670, LG T670, LP T670 LSG T670, LSP T670, LSY T670, LOP T670, LYG T670 LG T671, LOG T671, LSG T671 LB T673, LV T673, LT T673, LW T673 LH T674 LS T676, LA T676, LO T676, LY T676, LB T676, LH T676, LSB T676, LW T676 LB T67C, LV T67C, LT T67C, LS T67K, LO T67K, LY T67K, LW E67C LS E67B, LA E67B, LO E67B, LY E67B, LB E67C, LV E67C, LT E67C LW T67C LS T679, LY T679, LG T679 LS T770, LO T770, LY T770, LG T770, LP T770 LB T773, LV T773, LT T773, LW T773 LH T774 LS E675, LA E675, LY E675, LS T675 LS T776, LA T776, LO T776, LY T776, LB T776 LHGB T686 LT T68C, LB T68C - Hyper Mini TOPLED® LB M676 - Mini TOPLED Santana® LG M470 LS M47K, LO M47K, LY M47K Source: http://www.osram.convergy.de/
LDR = photo-elements:?1060*: Sensor Street Light control Source: http://optoelectronics.perkinelmer.com/content/Datasheets/DTS_PhotocellsB1060.pdf
LED_ = SpaceDIY_passive_components:LED_RGB_PLCC-6: Full Color PLCC6 LED OVSTRGBBCR8 Source: www.optekinc.com .. ovstrgbbcr8.pdf
MIC = microphon:ELECTRET_MICROPHON-: Electret Condenser Microphone
NTC = adafruit:R-US_: RESISTOR, American symbol
P1 = SpaceDIY:SLIDE_POT_20MM
P2 P3 = audio-pots:ALPS_RK09K_VERTICAL
PB1-PB9 = Seeed-OPL-Switch:SMD-SWITCH-TACTILE-SPST-NO/TS-1109(4P-D6.0MM): 311020024; MPN: TS-1109
PH1 PH34 = pinhead:PINHD-1X1: PIN HEADER
PH2-PH10 PH21 = pinhead:PINHD-1X2: PIN HEADER
PH11 PH12 PH14-PH20 PH22-PH30 PH38 PH64 = pinhead:PINHD-1X3: PIN HEADER
PH31 PH58-PH62 = pinhead:PINHD-1X30: PIN HEADER
PH32 PH33 PH35-PH37 PH65 = pinhead:PINHD-1X4: PIN HEADER
PH39 PH40 = pinhead:PINHD-1X6: PIN HEADER
PH41 = pinhead:PINHD-2X7: PIN HEADER
PH42-PH46 = pinhead:PINHD-1X8: PIN HEADER
PH47 = pinhead:PINHD-1X9: PIN HEADER
PH48-PH57 = adafruit:PINHD-1X10: Pin header 1x10 0.1" spacing With round pins
PH63 = con-lstb:MA08-2: PIN HEADER; OC_FARNELL: unknown; OC_NEWARK: unknown
R1-R39 R41-R59 = resistor:R-US_: RESISTOR, American symbol
R40 R60 R67 = SpaceDIY_passive_components:R0603
S1 = bt_electromech:DPDT: Dual Position, Dual Throw (DPDT) Switch
SP1 = SpaceDIY:32MM_SPEAKER
T1-T3 = transistor:*-NPN-: NPN Transistror BF959 corrected 2008.03.06
T4 T5 = transistor:*-PNP-: PNP Transistror
U1 = daspilker:USB-RECEPTABLE: USB Receptable
U2 = SparkFun:GAS_SENSOR: MQ-3 Gas Sensor. FP not tested. Part#
U$16 = SpaceDIY:RESISTIVE_SENSOR_PAD